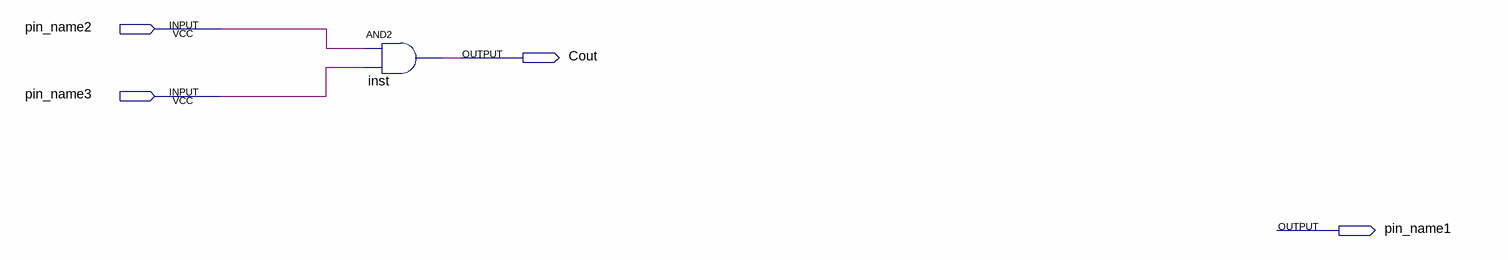
[diagram p0: schematic sheet]
// Quartus schematic carry_de_saida.bdf as structural Verilog: 1 symbols, 4 pins
module carry_de_saida (
  input  pin_name2,
  input  pin_name3,
  output Cout,
  output pin_name1
);

  and inst (Cout, pin_name2, pin_name3);
endmodule
